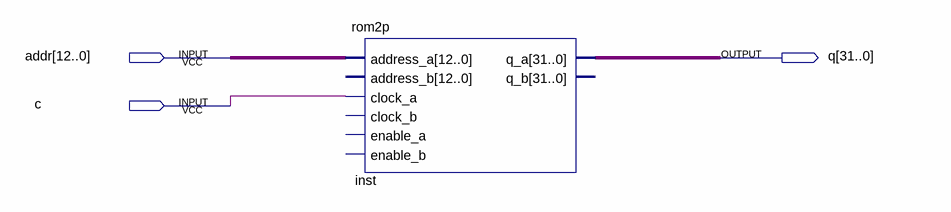
[diagram p0: schematic sheet]
// Quartus schematic romtest.bdf as structural Verilog: 1 symbols, 3 pins
module romtest (
  input  [12:0] addr,
  input  c,
  output [31:0] q
);

  rom2p inst (.address_a(addr), .clock_a(c), .q_a(q));  // open: address_b, clock_b, enable_a, enable_b, q_b
endmodule
